# Altium schematic sheet P3_MS.SchDoc
size 279 x 177 mm
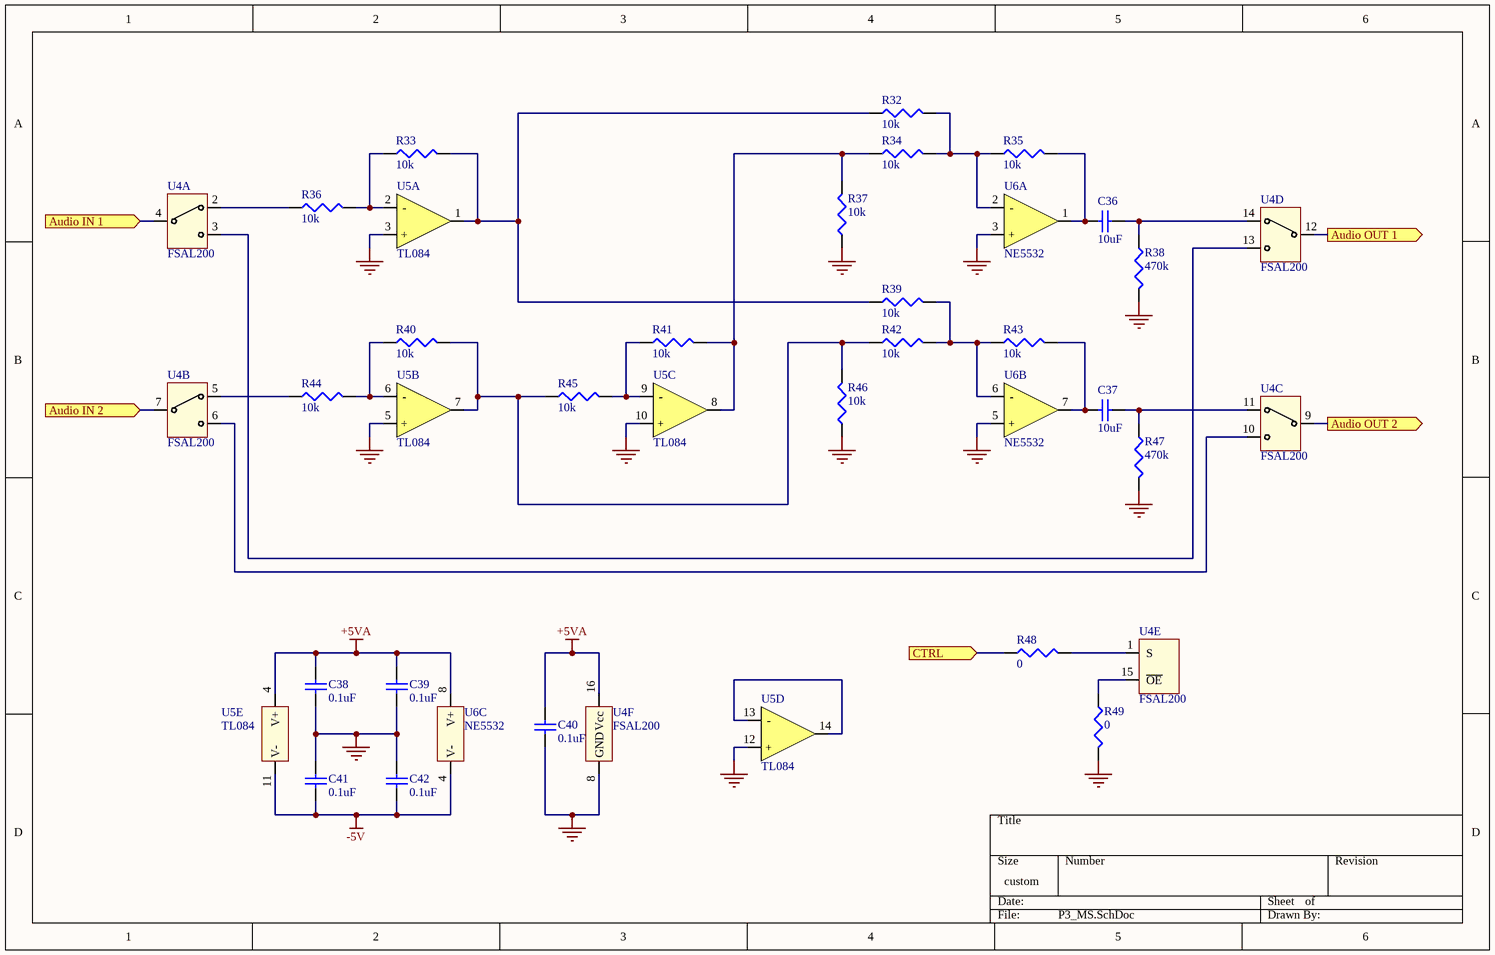
[diagram p0: P3_MS.SchDoc]

## Parts
C36  10uF  [CAP 0603 (1608 metric)]
C37  10uF  [CAP 0603 (1608 metric)]
C38  0.1uF  [CAP 0603 (1608 metric)]
C39  0.1uF  [CAP 0603 (1608 metric)]
C40  0.1uF  [CAP 0603 (1608 metric)]
C41  0.1uF  [CAP 0603 (1608 metric)]
C42  0.1uF  [CAP 0603 (1608 metric)]
R32  10k  [RES 0603 (1608 metric)]
R33  10k  [RES 0603 (1608 metric)]
R34  10k  [RES 0603 (1608 metric)]
R35  10k  [RES 0603 (1608 metric)]
R36  10k  [RES 0603 (1608 metric)]
R37  10k  [RES 0603 (1608 metric)]
R38  470k  [RES 0603 (1608 metric)]
R39  10k  [RES 0603 (1608 metric)]
R40  10k  [RES 0603 (1608 metric)]
R41  10k  [RES 0603 (1608 metric)]
R42  10k  [RES 0603 (1608 metric)]
R43  10k  [RES 0603 (1608 metric)]
R44  10k  [RES 0603 (1608 metric)]
R45  10k  [RES 0603 (1608 metric)]
R46  10k  [RES 0603 (1608 metric)]
R47  470k  [RES 0603 (1608 metric)]
R48  0  [RES 0603 (1608 metric)]
R49  0  [RES 0603 (1608 metric)]
U4  FSAL200  (parts A,B,C,D,E,F of 6)
U5  TL084  (parts A,B,C,D,E of 5)
U6  NE5532  (parts A,B,C of 3)

## Ports
Audio IN 1 (in), Audio IN 2 (in), Audio OUT 1 (out), Audio OUT 2 (out), CTRL (in)

## Nets
+5VA: C38.1 C39.1 C40.1 U4.16(Vcc) U5.4(V+) U6.8(V+)
-5V: C41.2 C42.2 U5.11(V-) U6.4(V-)
GND: C38.2 C39.2 C40.2 C41.1 C42.1 R37.1 R38.2 R46.1 R47.2 R49.2 U4.8(GND) U5.3(+) U5.5(+) U5.10(+) U5.12(+) U6.3(+) U6.5(+)
Audio IN 1: U4.4(A) ; port Audio IN 1
Audio IN 2: U4.7(A) ; port Audio IN 2
Audio OUT 1: U4.12(A) ; port Audio OUT 1
Audio OUT 2: U4.9(A) ; port Audio OUT 2
CTRL: R48.1 ; port CTRL
NetC36_1: C36.1 R38.1 U4.14(B1)
NetC36_2: C36.2 R35.2 U6.1(OUT)
NetC37_1: C37.1 R47.1 U4.11(B1)
NetC37_2: C37.2 R43.2 U6.7(OUT)
NetR32_1: R32.1 R33.2 R39.1 U5.1(OUT)
NetR32_2: R32.2 R34.2 R35.1 U6.2(-)
NetR33_1: R33.1 R36.2 U5.2(-)
NetR34_1: R34.1 R37.2 R41.2 U5.8(OUT)
NetR36_1: R36.1 U4.2(B1)
NetR39_2: R39.2 R42.2 R43.1 U6.6(-)
NetR40_1: R40.1 R44.2 U5.6(-)
NetR40_2: R40.2 R42.1 R45.1 R46.2 U5.7(OUT)
NetR41_1: R41.1 R45.2 U5.9(-)
NetR44_1: R44.1 U4.5(B1)
NetR48_2: R48.2 U4.1(S)
NetR49_1: R49.1 U4.15(~{OE})
NetU4_3: U4.3(B2) U4.13(B2)
NetU4_6: U4.6(B2) U4.10(B2)
NetU5_13: U5.13(-) U5.14(OUT)

## Library data of the parts
C36-C42 = Cap Semi: Capacitor (Semiconductor SIM Model)
  C36 C37: Value: 10uF
  C38-C42: Value: 0.1uF
R32-R49 = Res3: Resistor
  R32-R37 R39-R46: Value: 10k
  R38 R47: Value: 470k
  R48 R49: Value: 0
U4 = FSAL200: Quad 2:1 Multiplexer
U5 = TL084: Quad Audio OpAmp
U6 = NE5532: Dual Audio OpAmp